# Altium project BQ25895-TEST.PrjPcb
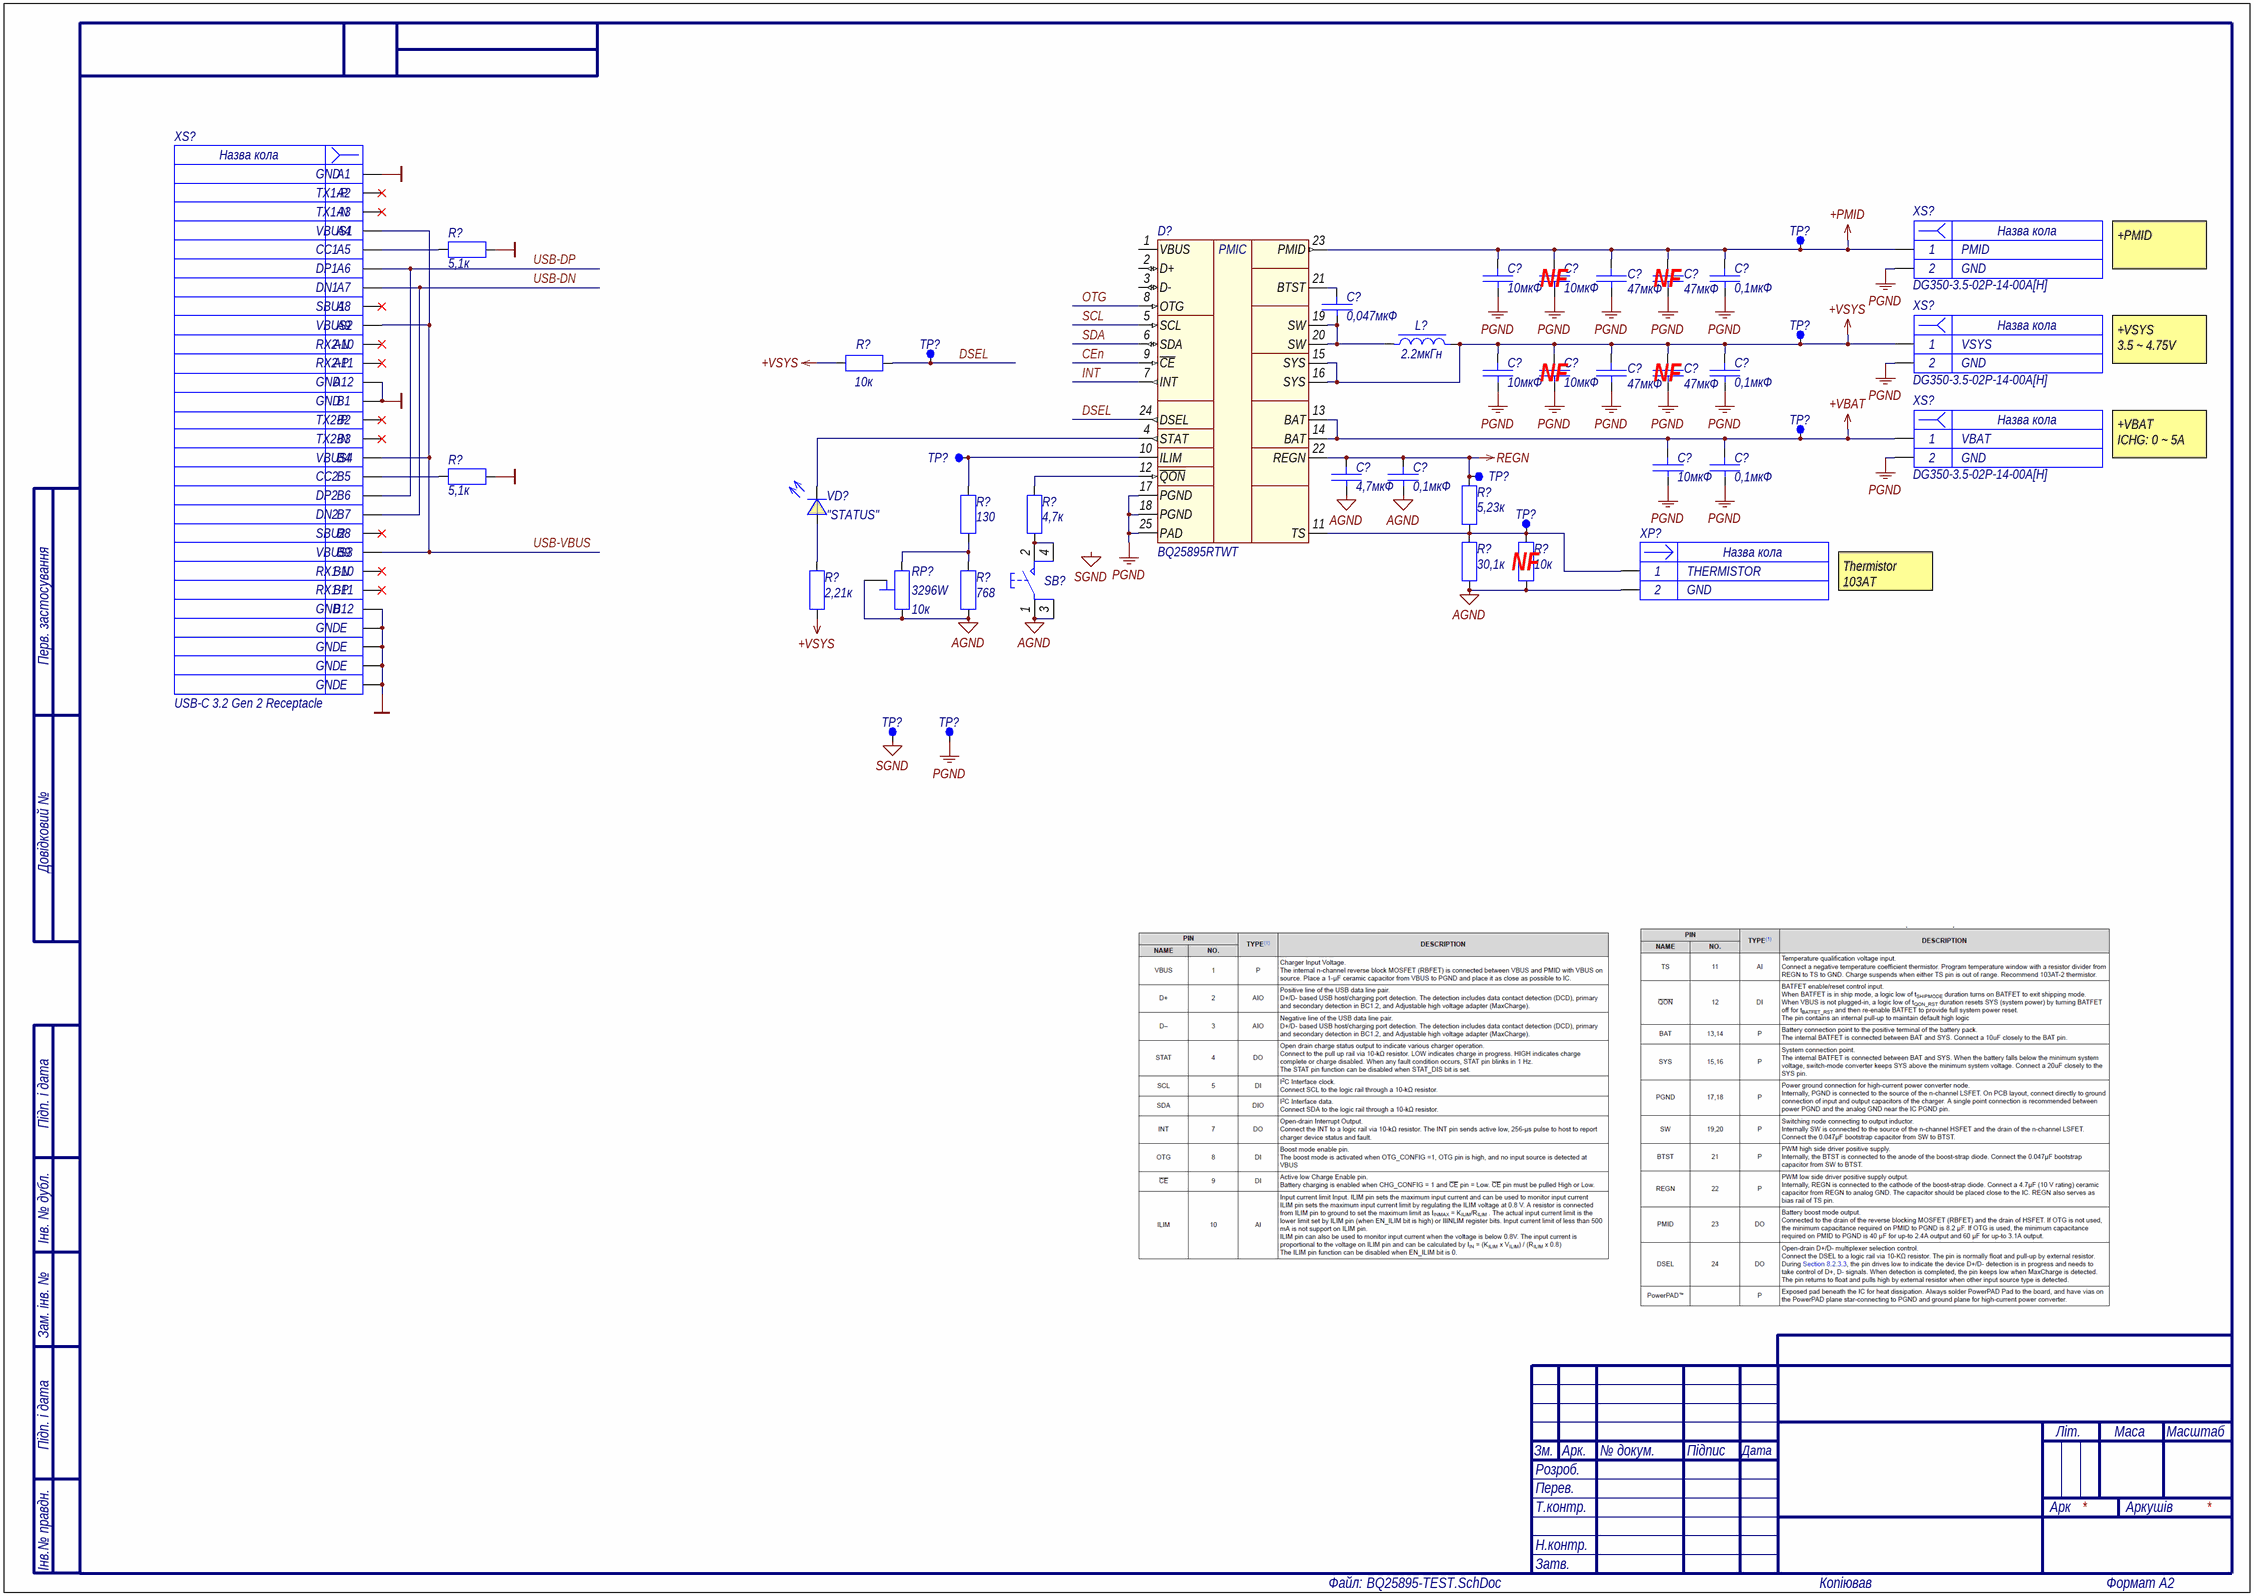
[diagram p0: BQ25895-TEST.SchDoc]
1 sheet, 44 parts. Net scope: global (net labels, ports and power ports of the same name join across sheets).
Board file: BQ25895-TEST.PcbDoc

## Sheet BQ25895-TEST.SchDoc
size 594 x 420 mm

### Parts
(Parts that share a designator on the sheet are numbered #1, #2 ... from top to bottom, then left to right.)
C?#1  value 10мкФ  [CAPC_0805_2.0x1.2x1.35mm]  (hidden comment: 10uF)
C?#2  value 10мкФ  [CAPC_0805_2.0x1.2x1.35mm]  (hidden comment: 10uF)
C?#3  value 47мкФ  [CAPC_1206_3.2x1.6x1.8mm]  (hidden comment: 47uF)
C?#4  value 47мкФ  [CAPC_1206_3.2x1.6x1.8mm]  (hidden comment: 47uF)
C?#5  value 0,1мкФ  [CAPC_0603_1.6x0.8x0.9mm]  (hidden comment: 0.1uF)
C?#6  value 0,047мкФ  [CAPC_0603_1.6x0.8x0.9mm]  (hidden comment: 0.47uF)
C?#7  value 10мкФ  [CAPC_0805_2.0x1.2x1.35mm]  (hidden comment: 10uF)
C?#8  value 10мкФ  [CAPC_0805_2.0x1.2x1.35mm]  (hidden comment: 10uF)
C?#9  value 47мкФ  [CAPC_1206_3.2x1.6x1.8mm]  (hidden comment: 47uF)
C?#10  value 47мкФ  [CAPC_1206_3.2x1.6x1.8mm]  (hidden comment: 47uF)
C?#11  value 0,1мкФ  [CAPC_0603_1.6x0.8x0.9mm]  (hidden comment: 0.1uF)
C?#12  value 10мкФ  [CAPC_0805_2.0x1.2x1.35mm]  (hidden comment: 10uF)
C?#13  value 0,1мкФ  [CAPC_0603_1.6x0.8x0.9mm]  (hidden comment: 0.1uF)
C?#14  value 4,7мкФ  [CAPC_0805_2.0x1.2x1.35mm]  (hidden comment: 4.7uF)
C?#15  value 0,1мкФ  [CAPC_0603_1.6x0.8x0.9mm]  (hidden comment: 0.1uF)
D?  BQ25895RTWT  [TI_RTW0024A_QFN50P400X400X80_HS-25N]
L?  value 2.2мкГн  [INDPWR_VISHAY_IHLP-2525CZ-01]  (hidden comment: 2.2uH)
R?#1  value 5,1к  [RESC_0603_1.6x0.8x0.45mm]  (hidden comment: 5.1k)
R?#2  value 10к  [RESC_0603_1.6x0.8x0.45mm]  (hidden comment: 10k)
R?#3  value 5,1к  [RESC_0603_1.6x0.8x0.45mm]  (hidden comment: 5.1k)
R?#4  value 5,23к  [RESC_0603_1.6x0.8x0.45mm]  (hidden comment: 5.23k)
R?#5  value 130  [RESC_0603_1.6x0.8x0.45mm]  (hidden comment: 130R)
R?#6  value 4,7к  [RESC_0603_1.6x0.8x0.45mm]  (hidden comment: 4.7k)
R?#7  value 30,1к  [RESC_0603_1.6x0.8x0.45mm]  (hidden comment: 30.1k)
R?#8  value 10к  [RESC_0603_1.6x0.8x0.45mm]  (hidden comment: 10k)
R?#9  value 2,21к  [RESC_0603_1.6x0.8x0.45mm]  (hidden comment: 2.21k)
R?#10  value 768  [RESC_0603_1.6x0.8x0.45mm]  (hidden comment: 768R)
RP?  3296W  value 10к  [Bourns_3296W]
SB?  431181015816  [SWITCH TACTILE SPST-NO Wurth 431181015816]  (value not drawn)
TP?#1  *  [TEST POINT PAD 1MM SILK]  (value not drawn)  (no BOM)
TP?#2  *  [TEST POINT PAD 1MM SILK]  (value not drawn)  (no BOM)
TP?#3  *  [TEST POINT PAD 1MM SILK]  (value not drawn)  (no BOM)
TP?#4  *  [TEST POINT PAD 1MM SILK]  (value not drawn)  (no BOM)
TP?#5  *  [TEST POINT PAD 1MM SILK]  (value not drawn)  (no BOM)
TP?#6  *  [TEST POINT PAD 1MM SILK]  (value not drawn)  (no BOM)
TP?#7  *  [TEST POINT PAD 1MM SILK]  (value not drawn)  (no BOM)
TP?#8  *  [TEST POINT PAD 1MM SILK]  (value not drawn)  (no BOM)
TP?#9  *  [TEST POINT PAD 1MM SILK]  (value not drawn)  (no BOM)
VD?  "STATUS"  [LED_0603_1.6x0.8x0.75mm_YELLOW]
XP?  Pin2NetName: GND  Pin1NetName: THERMISTOR  [XH 2M 2.5mm R/A PTH JST S2B-XH-A]  (hidden comment: S2B-XH-A)
XS?#1  USB-C 3.2 Gen 2 Receptacle  [USB 3.2 TYPE-C RCPT R/A SMT Amphenol 12401598E4#2A]
XS?#2  Pin2NetName: GND  Pin1NetName: PMID  [Terminal Block Screw 2P 3.5mm PTH DEGSON DG350-3.5-02P-14-00A[H]]  (hidden comment: DG350-3.5-02P-14-00A[H])
XS?#3  Pin2NetName: GND  Pin1NetName: VSYS  [Terminal Block Screw 2P 3.5mm PTH DEGSON DG350-3.5-02P-14-00A[H]]  (hidden comment: DG350-3.5-02P-14-00A[H])
XS?#4  Pin2NetName: GND  Pin1NetName: VBAT  [Terminal Block Screw 2P 3.5mm PTH DEGSON DG350-3.5-02P-14-00A[H]]  (hidden comment: DG350-3.5-02P-14-00A[H])

### Nets
+PMID: C?#1.1 C?#2.1 C?#3.1 C?#4.1 C?#5.1 D?.23(PMID) TP?#1.1 XS?#2.1
+VBAT: C?#12.1 C?#13.1 D?.13(BAT) D?.14(BAT) TP?#4.1 XS?#4.1
+VSYS: C?#7.1 C?#8.1 C?#9.1 C?#10.1 C?#11.1 D?.15(SYS) D?.16(SYS) L?.2 R?#2.2 R?#9.1 TP?#2.1 XS?#3.1
AGND: C?#14.2 C?#15.2 R?#7.1 R?#8.1 R?#10.1 RP?.2 RP?.3 SB?.1 SB?.3 XP?.2
GND: R?#1.1 R?#3.1 XS?#1.A1 XS?#1.A12 XS?#1.B1 XS?#1.B12 XS?#1.SH1(E1) XS?#1.SH2(E2) XS?#1.SH3(E3) XS?#1.SH4(E4)
PGND: C?#1.2 C?#2.2 C?#3.2 C?#4.2 C?#5.2 C?#7.2 C?#8.2 C?#9.2 C?#10.2 C?#11.2 C?#12.2 C?#13.2 D?.17(PGND) D?.18(PGND) D?.25(PAD) TP?#9.1 XS?#2.2 XS?#3.2 XS?#4.2
REGN: C?#14.1 C?#15.1 D?.22(REGN) R?#4.2 TP?#6.1
SGND: TP?#8.1
CEn: D?.9(~{CE})
DSEL: D?.24(DSEL) R?#2.1 TP?#3.1
INT: D?.7(INT)
OTG: D?.8(OTG)
SCL: D?.5(SCL)
SDA: D?.6(SDA)
USB-DN: XS?#1.A7 XS?#1.B7
USB-DP: XS?#1.A6 XS?#1.B6
USB-VBUS: XS?#1.A4 XS?#1.A9 XS?#1.B4 XS?#1.B9
NetC?#6_1: C?#6.1 D?.21(BTST)
NetC?#6_2: C?#6.2 D?.19(SW) D?.20(SW) L?.1
NetD?_4: D?.4(STAT) VD?.1(K)
NetD?_10: D?.10(ILIM) R?#5.2 TP?#5.1
NetD?_11: D?.11(TS) R?#4.1 R?#7.2 R?#8.2 TP?#7.1 XP?.1
NetD?_12: D?.12(~{QON}) R?#6.2
NetR?#1_2: R?#1.2 XS?#1.A5
NetR?#3_2: R?#3.2 XS?#1.B5
NetR?#5_1: R?#5.1 R?#10.2 RP?.1
NetR?#6_1: R?#6.1 SB?.2 SB?.4
NetR?#9_2: R?#9.2 VD?.2(A)

Not connected (* = marked no-connect by the designer): D? 1(VBUS) 2(D+) 3(D-); XS?#1 A2* A3* A8* A10* A11* B2* B3* B8* B10* B11*

### Notes on the sheet
- +PMID
- (near C?#2) NF
- (near C?#4) NF
- +VSYS
  3.5 ~ 4.75V
- (near C?#8) NF
- (near C?#10) NF
- +VBAT
  ICHG: 0 ~ 5A
- (near R?#8) NF
- Thermistor
  103AT
- Labels drawn without touching a wire or pin: SGND
- Перв. застосування
- Довідковий №
- Підп. і дата
- Інв. № дубл.
- Зам. інв. №
- Зм.
- Розроб.
- Арк.
- № докум.
- Підпис
- Дата
- Літ.
- Маса
- Масштаб
- Перев.
- Т.контр.
- Арк
- Аркушів
- Н.контр.
- Затв.
- Інв.№ правдн.
- Файл:
- Копіював
- Формат А2
- (in symbol Terminal Block Screw 2P 3.5mm PTH DEGSON DG350-3.5-02P-14-00A[H]) Назва кола
- (in symbol USB 3.2 TYPE-C RCPT RA SMT Amphenol 12401598E4#2A) Назва кола; GND; TX1-P; TX1-N; VBUS1; CC1; DP1; DN1; SBU1; VBUS2; RX2-N; RX2-P; TX2-P; TX2-N; VBUS4; CC2; DP2; DN2; SBU2; VBUS3; RX1-N; RX1-P; E
- (in symbol XH 2M R/A PTH JST S2B-XH-A) Назва кола

### Library data of the parts
C?#1 C?#2 C?#7 C?#8 C?#12 = CAP_FIXED_SMD_0805: Capacitor Ceramic 10uF ±10% 25V X7R 0805; Manufacturer: Murata; Part Number: GRM21BZ71E106KE15L; Voltage: 25В; Type: Конденсатор керамічний; Name: 10мкФ ±10% 25В X7R 0805 GRM21BZ71E106KE15L [Murata]; Package: 0805; Tolerance: ±10%; Mount: SMT; Dielectric: X7R; Min Operating Temperature: -55°C; Max Operating Temperature: +125°C; ComponentLink1Description1: *; ComponentLink1Description: Datasheet Link; ComponentLink1Description: New link; Number of Pins: 2; Component Function: Capacitor
C?#3 C?#4 C?#9 C?#10 = CAP_FIXED_SMD_1206: Capacitor Ceramic 47uF ±20% 25V X5R 1206; Manufacturer: Murata; Part Number: GRM31CR61E476ME44K; Voltage: 25В; Type: Конденсатор керамічний; Name: 47мкФ ±20% 25В X5R 1206 GRM31CR61E476ME44K [Murata]; Package: 1206; Tolerance: ±20%; Mount: SMT; Dielectric: X5R; Min Operating Temperature: -55°C; Max Operating Temperature: +85°C; ComponentLink1Description1: *; ComponentLink1Description: Datasheet Link; ComponentLink1Description: New link; Number of Pins: 2; Component Function: Capacitor
C?#5 C?#11 C?#13 C?#15 = CAP_FIXED_SMD_0603: Capacitor Ceramic 0.1uF ±10% 50V X7R 0603; Manufacturer: Murata; Part Number: GCM188R71H104KA57D; Voltage: 50В; Type: Конденсатор керамічний; Name: 0,1мкФ ±10% 50В X7R 0603 GCM188R71H104KA57D [Murata]; Package: 0603; Tolerance: ±10%; Mount: SMT; Dielectric: X7R; Min Operating Temperature: -55°C; Max Operating Temperature: +125°C; ComponentLink1Description1: *; ComponentLink1Description: Datasheet Link; ComponentLink1Description: New link; Number of Pins: 2; Component Function: Capacitor
C?#6 = CAP_FIXED_SMD_0603: Capacitor Ceramic 0.47uF ±10% 50V X7R 0603; Manufacturer: Murata; Part Number: GCM188R71H473KA55D; Voltage: 50В; Type: Конденсатор керамічний; Name: 0,047мкФ ±10% 50В X7R 0603 GCM188R71H473KA55D [Murata]; Package: 0603; Tolerance: ±10%; Mount: SMT; Dielectric: X7R; Min Operating Temperature: -55°C; Max Operating Temperature: +125°C; ComponentLink1Description1: *; ComponentLink1Description: Datasheet Link; ComponentLink1Description: New link; Number of Pins: 2; Component Function: Capacitor
C?#14 = CAP_FIXED_SMD_0805: Capacitor Ceramic 4.7uF ±10% 25V X7R 0805; Manufacturer: Murata; Part Number: GCM21BC71E475KE36L; Voltage: 25В; Type: Конденсатор керамічний; Name: 4,7мкФ ±10% 25В X7R 0805 GCM21BC71E475KE36L [Murata]; Package: 0805; Tolerance: ±10%; Mount: SMT; Dielectric: X7R; Min Operating Temperature: -55°C; Max Operating Temperature: +125°C; ComponentLink1Description1: *; ComponentLink1Description: Datasheet Link; ComponentLink1Description: New link; Number of Pins: 2; Component Function: Capacitor
D? = BQ25895RTWT: I2C Controlled Single Cell 5-A Fast Charger with MaxCharge for High Input Voltage and Adjustable Voltage 3.1-A Boost Operation 24-WFQFN EP [4x4]; Manufacturer: Texas Instruments; Type: Мікросхема; Name: BQ25895RTWT [Texas Instruments]; Component Function: PMIC; Package: 24-WFQFN EP [4x4]; Mount: SMT; Max Operating Temperature: +85°C; ComponentLink1Description1: *; ComponentLink1Description: New link; Number of Pins: 25; Min Operating Temperature: -40°C; Part Number: BQ25895RTWT
L? = INDPWR_Vishay_IHLP-2525CZ-01: 2.2uH Shielded Molded Inductor 20% 8A 20mOhm 2-SMD [6.86x6.47mm]; Manufacturer: Vishay; Part Number: IHLP2525CZER2R2M01; Type: Котушка індуктивності; Name: 2.2мкГн ±20% 8 A 2-SMD [6.86x6.47mm] IHLP2525CZER2R2M01 [Vishay]; DC Resistance (DCR) (Max): 20 мОм; Q @ Frequency: * @ 100 кГц; SRF: * МГц; Package: 2-SMD [6.86x6.47mm]; Current Rating (Max): 8 A; Mount: SMT; Min Operating Temperature: -55°C; Max Operating Temperature: +125°C; ComponentLink1Description1: *; ComponentLink1Description: Datasheet Link; Number of Pins: 2; Tolerance: ±20%; Component Function: *; ComponentLink1Description: New link; ComponentLink1URL: *
R?#1 R?#3 = RES_FIXED_SMD_0603: Resistor SMD 5.1k Ohm ±1% ±100ppm/°C 1/10W 0603; Manufacturer: Yageo; Part Number: RC0603FR-075K1L; Power Rating: 1/10 Вт; Name: 5,1кОм ±1% 1/10 Вт 0603 RC0603FR-075K1L [Yageo]; Package: 0603; Tolerance: ±1%; Type: Резистор; Mount: SMT; Min Operating Temperature: -55°C; Max Operating Temperature: +125°C; ComponentLink1Description1: *; ComponentLink1Description: Datasheet Link; ComponentLink1Description: New link; Number of Pins: 2; Component Function: Resistor
R?#2 R?#8 = RES_FIXED_SMD_0603: Resistor SMD 10k Ohm ±1% ±100ppm/°C 1/10W 0603; Manufacturer: Yageo; Part Number: RC0603FR-0710KL; Power Rating: 1/10 Вт; Name: 10кОм ±1% 1/10 Вт 0603 RC0603FR-0710KL [Yageo]; Package: 0603; Tolerance: ±1%; Type: Резистор; Mount: SMT; Min Operating Temperature: -55°C; Max Operating Temperature: +125°C; ComponentLink1Description1: *; ComponentLink1Description: Datasheet Link; ComponentLink1Description: New link; Number of Pins: 2; Component Function: Resistor
R?#4 = RES_FIXED_SMD_0603: Resistor SMD 5.23k Ohm ±1% ±100ppm/°C 1/10W 0603; Manufacturer: Yageo; Part Number: RC0603FR-075K23L; Power Rating: 1/10 Вт; Name: 5,23кОм ±1% 1/10 Вт 0603 RC0603FR-075K23L [Yageo]; Package: 0603; Tolerance: ±1%; Type: Резистор; Mount: SMT; Min Operating Temperature: -55°C; Max Operating Temperature: +125°C; ComponentLink1Description1: *; ComponentLink1Description: Datasheet Link; ComponentLink1Description: New link; Number of Pins: 2; Component Function: Resistor
R?#5 = RES_FIXED_SMD_0603: Resistor SMD 130 Ohm ±1% ±100ppm/°C 1/10W 0603; Manufacturer: Yageo; Part Number: RC0603FR-07130RL; Power Rating: 1/10 Вт; Name: 130Ом ±1% 1/10 Вт 0603 RC0603FR-07130RL [Yageo]; Package: 0603; Tolerance: ±1%; Type: Резистор; Mount: SMT; Min Operating Temperature: -55°C; Max Operating Temperature: +125°C; ComponentLink1Description1: *; ComponentLink1Description: Datasheet Link; ComponentLink1Description: New link; Number of Pins: 2; Component Function: Resistor
R?#6 = RES_FIXED_SMD_0603: Resistor SMD 4.7k Ohm ±1% ±100ppm/°C 1/10W 0603; Manufacturer: Yageo; Part Number: RC0603FR-074K7L; Power Rating: 1/10 Вт; Name: 4,7кОм ±1% 1/10 Вт 0603 RC0603FR-074K7L [Yageo]; Package: 0603; Tolerance: ±1%; Type: Резистор; Mount: SMT; Min Operating Temperature: -55°C; Max Operating Temperature: +125°C; ComponentLink1Description1: *; ComponentLink1Description: Datasheet Link; ComponentLink1Description: New link; Number of Pins: 2; Component Function: Resistor
R?#7 = RES_FIXED_SMD_0603: Resistor SMD 30.1k Ohm ±1% ±100ppm/°C 1/10W 0603; Manufacturer: Yageo; Part Number: RC0603FR-0730K1L; Power Rating: 1/10 Вт; Name: 30,1кОм ±1% 1/10 Вт 0603 RC0603FR-0730K1L [Yageo]; Package: 0603; Tolerance: ±1%; Type: Резистор; Mount: SMT; Min Operating Temperature: -55°C; Max Operating Temperature: +125°C; ComponentLink1Description1: *; ComponentLink1Description: Datasheet Link; ComponentLink1Description: New link; Number of Pins: 2; Component Function: Resistor
R?#9 = RES_FIXED_SMD_0603: Resistor SMD 2.21k Ohm ±1% ±100ppm/°C 1/10W 0603; Manufacturer: Yageo; Part Number: RC0603FR-072K21L; Power Rating: 1/10 Вт; Name: 2,21кОм ±1% 1/10 Вт 0603 RC0603FR-072K21L [Yageo]; Package: 0603; Tolerance: ±1%; Type: Резистор; Mount: SMT; Min Operating Temperature: -55°C; Max Operating Temperature: +125°C; ComponentLink1Description1: *; ComponentLink1Description: Datasheet Link; ComponentLink1Description: New link; Number of Pins: 2; Component Function: Resistor
R?#10 = RES_FIXED_SMD_0603: Resistor SMD 768 Ohm ±1% ±100ppm/°C 1/10W 0603; Manufacturer: Yageo; Part Number: RC0603FR-07768RL; Power Rating: 1/10 Вт; Name: 768Ом ±1% 1/10 Вт 0603 RC0603FR-07768RL [Yageo]; Package: 0603; Tolerance: ±1%; Type: Резистор; Mount: SMT; Min Operating Temperature: -55°C; Max Operating Temperature: +125°C; ComponentLink1Description1: *; ComponentLink1Description: Datasheet Link; ComponentLink1Description: New link; Number of Pins: 2; Component Function: Resistor
RP? = 3296W_Bourns: 25 Turns Trimmer Potentiometer 3296W  [10x5x12 mm]; Manufacturer: Bourns; Part Number: 3296W-1-103RLF; Tolerance: ±10%; Power Rating: 1/2 Вт; Name: 10кОм ±10% 1/2 Вт PTH [10x5x12 mm] 3296W-1-103RLF [Bourns]; Package: PTH [10x5x12 mm]; Type: Резистор підстроювальний; Mount: SMT; Min Operating Temperature: -55°C; Max Operating Temperature: +85°C; ComponentLink1Description1: *; ComponentLink1Description: Datasheet Link; ComponentLink1Description: New link; Number of Pins: 3; Component Function: *
SB? = SWITCH TACTILE SPST-NO Wurth 431181015816: Tactile Switch SPST-NO Top Actuated SMT; Manufacturer: Würth Elektronik; Name: 431181015816 Würth Elektronik; Part Number: 431181015816; Type: Вимикач кнопковий; Mount: SMT; Min Operating Temperature: -40°C; Max Operating Temperature: +85°C; ComponentLink1Description1: *; ComponentLink1Description: Datasheet Link; ComponentLink1Description: New link; Number of Pins: 4; Component Function: Switch Tactile
TP?#1-TP?#9 = TEST POINT SMD 1MM: Test Point Pad; Value: *; Component Function: *
VD? = LED SMD 0603 YELLOW: LED Yellow 2V 20mA SMD 0603; Manufacturer: Kingbright; Part Number: APT1608SYCK; Current: 20мА; Type: Діод; Name: APT1608SYCK [Kingbright]; Forward Voltage: 2В; Color: Жовтий; Package: 0603; Mount: SMT; Min Operating Temperature: -40°C; Max Operating Temperature: +85°C; ComponentLink1Description1: *; ComponentLink1Description: Datasheet Link; ComponentLink1Description: New link; Number of Pins: 2; Component Function: *
XP? = XH 2M R/A PTH JST S2B-XH-A: JST XH 2M R/A PTH 2.5mm; Part Number: S2B-XH-A(LF)(SN); Name: JST XH 2M R/A PTH 2.5mm S2B-XH-A(LF)(SN) [JST]; System: Connector; Max Operating Temperature: +85°C; Min Operating Temperature: -25°C; Mount: PTH; Number of Pins: 2; Type: Вилка; Manufacturer: JST; ComponentLink1Description: Datasheet Link; ComponentLink1URL: *; Mated with (Housing PN): *; Component Function: *
XS?#1 = USB 3.2 TYPE-C RCPT RA SMT Amphenol 12401598E4#2A: USB-C 3.2 Gen 2 (USB 3.1 Gen 2, Superspeed + (USB 3.1)) Receptacle Connector 24 Position Surface Mount, Right Angle; Name: USB-C 3.2 Gen 2 (USB 3.1 Gen 2, Superspeed + (USB 3.1)) Receptacle Connector 24 Position Surface Mount, Right Angle 12401598E4#2A [Amphenol]; Max Operating Temperature: +85°C; Min Operating Temperature: -40°C; Mount: SMT; Number of Pins: 24; Type: Розетка; Manufacturer: Amphenol; ComponentLink1Description: Datasheet Link; ComponentLink1URL: *; Mated with (Housing PN): *; System: Connector; Component Function: *; Part Number: 12401598E4#2A
XS?#2-XS?#4 = Terminal Block Screw 2P 3.5mm PTH DEGSON DG350-3.5-02P-14-00A[H]: 2 Position Wire to Board Terminal Block Horizontal 3.5mm PTH; Manufacturer: DEGSON; Name: 2 Position Wire to Board Terminal Block Horizontal 3.5mm PTH DG350-3.5-02P-14-00A[H] [DEGSON]; System: Connector; Max Operating Temperature: +105°C; Min Operating Temperature: -40°C; Mount: PTH; Number of Pins: 2; Type: Розетка; ComponentLink1Description: Datasheet Link; ComponentLink1URL: *; Mated with (Housing PN): *; Component Function: *; Part Number: DG350-3.5-02P-14-00A[H]